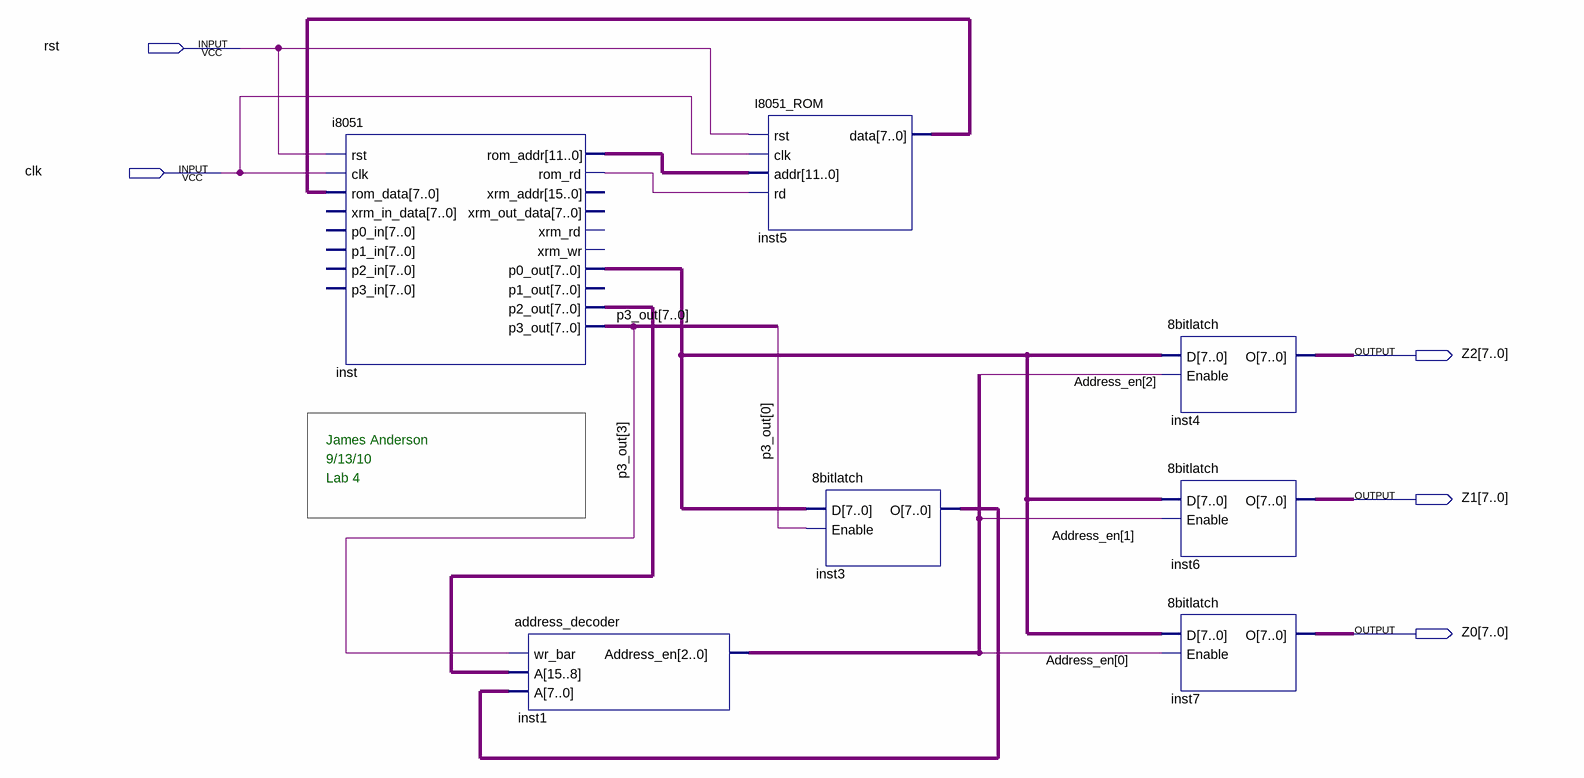
[diagram p0: schematic sheet]
// Quartus schematic Lab4_Top.bdf as structural Verilog: 7 symbols, 5 pins
module Lab4_Top (
  input  rst,
  input  clk,
  output [7:0] Z2,
  output [7:0] Z1,
  output [7:0] Z0
);

  wire inst_rom_rd;
  wire [2:0] Address_en, inst1_address_en;
  wire [7:0] inst3_o, inst5_data, inst_p0_out, inst_p2_out, p3_out;
  wire [11:0] inst_rom_addr;

  i8051 inst (
    .rst(rst), .clk(clk), .rom_data(inst5_data), .rom_addr(inst_rom_addr), .rom_rd(inst_rom_rd),
    .p0_out(inst_p0_out), .p2_out(inst_p2_out), .p3_out(p3_out));  // open: xrm_in_data, p0_in, p1_in, p2_in, p3_in, xrm_addr, xrm_out_data, xrm_rd, xrm_wr, p1_out
  address_decoder inst1 (.wr_bar(p3_out[3]), .A({inst_p2_out, inst3_o}), .Address_en(inst1_address_en));
  I8051_ROM inst5 (.rst(rst), .clk(clk), .addr(inst_rom_addr), .rd(inst_rom_rd), .data(inst5_data));
  \8bitlatch  inst3 (.D(inst_p0_out), .Enable(p3_out[0]), .O(inst3_o));
  \8bitlatch  inst4 (.D(inst_p0_out), .Enable(Address_en[2]), .O(Z2));
  \8bitlatch  inst6 (.D(inst_p0_out), .Enable(Address_en[1]), .O(Z1));
  \8bitlatch  inst7 (.D(inst_p0_out), .Enable(Address_en[0]), .O(Z0));

  // Notes on the sheet:
  //   James Anderson
  //   9/13/10
  //   Lab 4
endmodule
